# Altium schematic sheet Kello_uC.SchDoc
size A4; ApprovedBy: Krzysztof Belewicz; CheckedBy: Krzysztof Belewicz; Author: Krzysztof Belewicz; DrawnBy: Krzysztof Belewicz; Engineer: Krzysztof Belewicz; Revision: 1.0; SheetNumber: 1; SheetTotal: 4
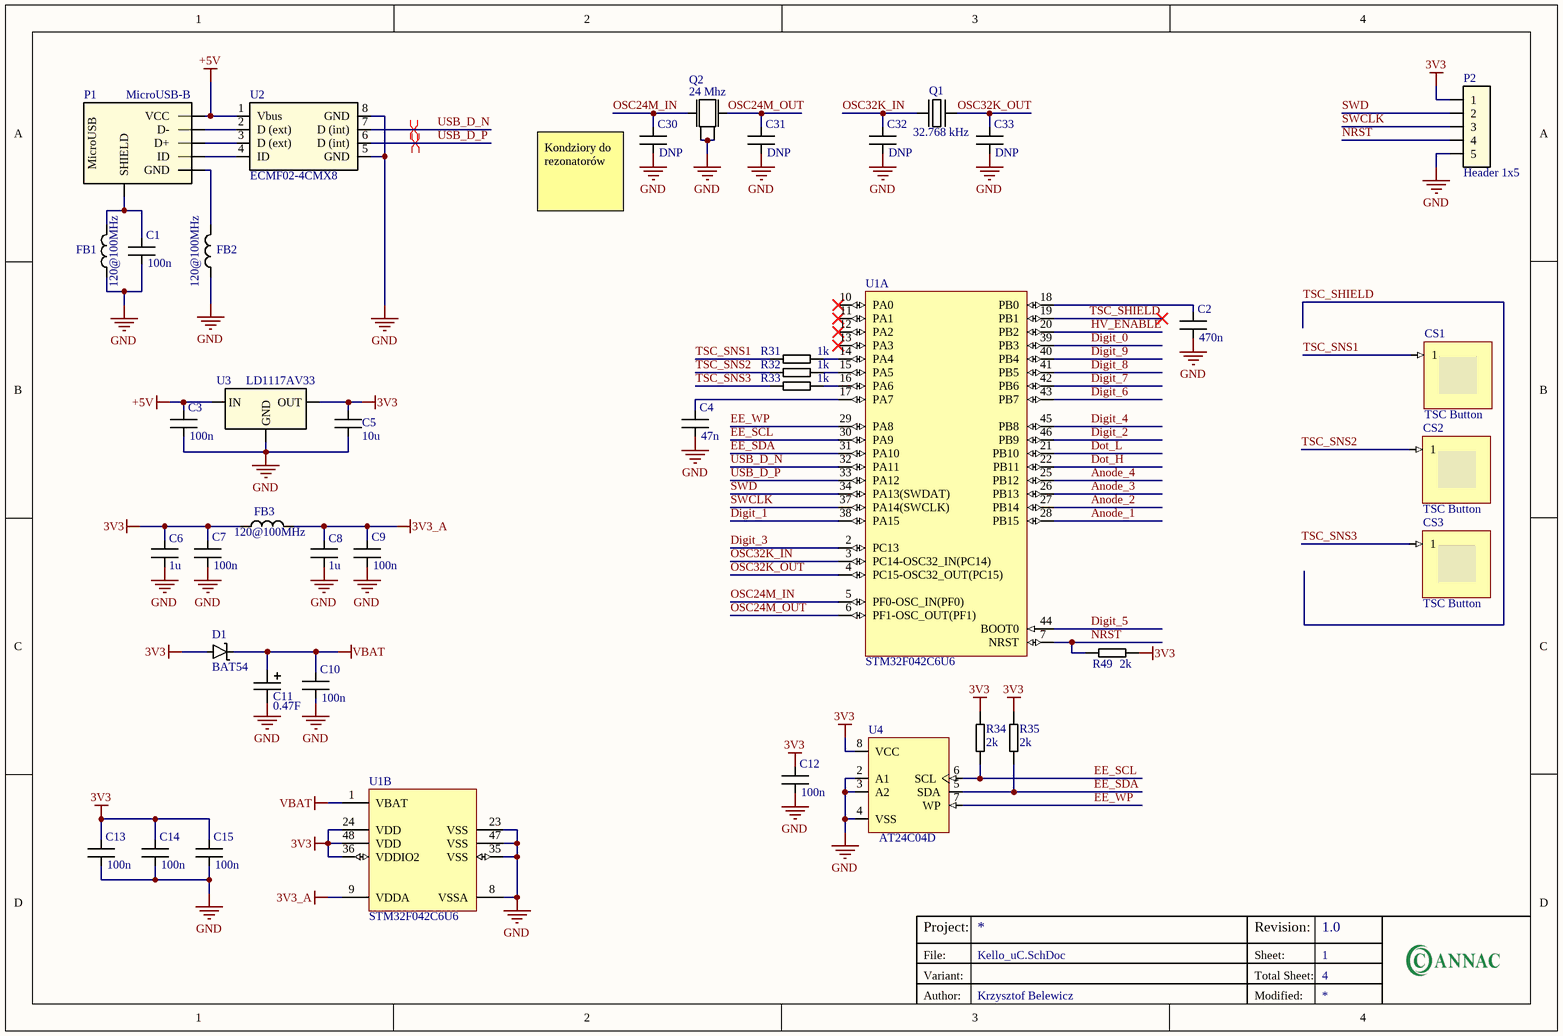
[diagram p0: Kello_uC.SchDoc]

## Parts
C1  value 100n  [CAPC1608N]  (hidden comment: Capacitor)
C2  value 470n  [CAPC1608N]  (hidden comment: Capacitor)
C3  value 100n  [CAPC1608N]  (hidden comment: Capacitor)
C4  value 47n  [CAPC1608N]  (hidden comment: Capacitor)
C5  value 10u  [CAPC1608N]  (hidden comment: Capacitor)
C6  value 1u  [CAPC1608N]  (hidden comment: Capacitor)
C7  value 100n  [CAPC1608N]  (hidden comment: Capacitor)
C8  value 1u  [CAPC1608N]  (hidden comment: Capacitor)
C9  value 100n  [CAPC1608N]  (hidden comment: Capacitor)
C10  value 100n  [CAPC1608N]  (hidden comment: Capacitor)
C11  0.47F  [FGH0V474ZF]
C12  value 100n  [CAPC1608N]  (hidden comment: Capacitor)
C13  value 100n  [CAPC1608N]  (hidden comment: Capacitor)
C14  value 100n  [CAPC1608N]  (hidden comment: Capacitor)
C15  value 100n  [CAPC1608N]  (hidden comment: Capacitor)
C30  value DNP  [CAPC1608N]  (hidden comment: Capacitor)
C31  value DNP  [CAPC1608N]  (hidden comment: Capacitor)
C32  value DNP  [CAPC1608N]  (hidden comment: Capacitor)
C33  value DNP  [CAPC1608N]  (hidden comment: Capacitor)
CS1  TSC Button  (no BOM)
CS2  TSC Button  (no BOM)
CS3  TSC Button  (no BOM)
D1  BAT54  [SOD-523F]
FB1  value 120@100MHz  [INDC1608N]  (hidden comment: Ferrite Bead)
FB2  value 120@100MHz  [INDC1608N]  (hidden comment: Ferrite Bead)
FB3  value 120@100MHz  [INDC1608N]  (hidden comment: Ferrite Bead)
P1  MicroUSB-B  [MicroUSB-B (47346-0001)]
P2  Header 1x5  [Header 1x5, Male, 2.54mm, Straight, THT]
Q1  value 32.768 kHz  [IL3X2]  (hidden comment: Crystal 2 pin)
Q2  value 24 Mhz  [CFPX-5]  (hidden comment: 24Mhz)
R31  value 1k  [RESC1608N]  (hidden comment: Resistor)
R32  value 1k  [RESC1608N]  (hidden comment: Resistor)
R33  value 1k  [RESC1608N]  (hidden comment: Resistor)
R34  value 2k  [RESC1608N]  (hidden comment: Resistor)
R35  value 2k  [RESC1608N]  (hidden comment: Resistor)
R49  value 2k  [RESC1608N]  (hidden comment: Resistor)
U1  STM32F042C6U6  [STM-UFQFPN48_N]  (parts A,B of 2)
U2  ECMF02-4CMX8  [uQFN-8]
U3  LD1117AV33  [SOT223_N]
U4  AT24C04D  [DFN-MC8]

## Nets
3V3: C5.2 C6.2 C7.2 C12.2 C13.2 C14.2 C15.2 D1.A FB3.1 P2.1 R34.1 R35.1 R49.2 U1.24(VDD) U1.36(VDDIO2) U1.48(VDD) U3.2(OUT) U4.8(VCC)
3V3_A: C8.2 C9.2 FB3.2 U1.9(VDDA)
+5V: C3.2 P1.1(VCC) U2.1(Vbus) U3.3(IN)
GND: C1.1 C2.1 C3.1 C4.1 C5.1 C6.1 C7.1 C8.1 C9.1 C10.1 C11.2 C12.1 C13.1 C14.1 C15.1 C30.1 C31.1 C32.1 C33.1 FB1.2 FB2.2 P2.5 Q2.2 Q2.4 U1.8(VSSA) U1.23(VSS) U1.35(VSS) U1.47(VSS) U2.5(GND) U2.8(GND) U3.1(GND) U4.2(A1) U4.3(A2) U4.4(VSS)
VBAT: C10.2 C11.1 D1.K U1.1(VBAT)
Anode_1: U1.28(PB15)
Anode_2: U1.27(PB14)
Anode_3: U1.26(PB13)
Anode_4: U1.25(PB12)
Digit_0: U1.39(PB3)
Digit_1: U1.38(PA15)
Digit_2: U1.46(PB9)
Digit_3: U1.2(PC13)
Digit_4: U1.45(PB8)
Digit_5: U1.44(BOOT0)
Digit_6: U1.43(PB7)
Digit_7: U1.42(PB6)
Digit_8: U1.41(PB5)
Digit_9: U1.40(PB4)
Dot_H: U1.22(PB11)
Dot_L: U1.21(PB10)
EE_SCL: R34.2 U1.30(PA9) U4.6(SCL)
EE_SDA: R35.2 U1.31(PA10) U4.5(SDA)
EE_WP: U1.29(PA8) U4.7(WP)
HV_ENABLE: U1.20(PB2)
NRST: P2.4 R49.1 U1.7(NRST)
OSC24M_IN: C30.2 Q2.1 U1.5(PF0-OSC_IN(PF0))
OSC24M_OUT: C31.2 Q2.3 U1.6(PF1-OSC_OUT(PF1))
OSC32K_IN: C32.2 Q1.1 U1.3(PC14-OSC32_IN(PC14))
OSC32K_OUT: C33.2 Q1.2 U1.4(PC15-OSC32_OUT(PC15))
SWCLK: P2.3 U1.37(PA14(SWCLK))
SWD: P2.2 U1.34(PA13(SWDAT))
TSC_SHIELD: U1.19(PB1)
TSC_SNS1: CS1.1 R31.1
TSC_SNS2: CS2.1 R32.1
TSC_SNS3: CS3.1 R33.1
USB_D_N: U1.32(PA11) U2.7(D_(int))
USB_D_P: U1.33(PA12) U2.6(D_(int))
NetC1_2: C1.2 FB1.1 P1.6(SHIELD)
NetC2_2: C2.2 U1.18(PB0)
NetC4_2: C4.2 U1.17(PA7)
NetFB2_1: FB2.1 P1.5(GND)
NetP1_2: P1.2(D-) U2.2(D_(ext))
NetP1_3: P1.3(D+) U2.3(D_(ext))
NetP1_4: P1.4(ID) U2.4(ID)
NetR31_2: R31.2 U1.14(PA4)
NetR32_2: R32.2 U1.15(PA5)
NetR33_2: R33.2 U1.16(PA6)

Not connected (* = marked no-connect by the designer): U1 10(PA0)* 11(PA1)* 12(PA2)* 13(PA3)*

## Layout directives
differential pair: USB_D_N, USB_D_P

## Notes on the sheet
- (near C30) Kondziory do rezonatorów
- Project:
- Variant:
- File:
- Sheet:
- Revision:
- Total Sheet:
- Author:
- Modified:
- (in symbol 47346-0001) MicroUSB

## Library data of the parts
C1 C3 C7 C9 C10 C12-C15 = Capacitor: Manufacturer Part Number 1: CL10F104ZA8NNNC; Manufacturer 1: SAMSUNG; Tolerance: -20/+80%; MaxVoltage: 25V; Supplier 1: TME; Supplier Part Number 1: CL10F104ZA8NNNC
C2 = Capacitor: Manufacturer Part Number 1: 0603B474K100CT; Manufacturer 1: WALSIN; Tolerance: 10%; MaxVoltage: 10V; Supplier 1: Farnell; Supplier Part Number 1: 2524844
C4 = Capacitor: Manufacturer Part Number 1: VJ0603Y473KXJCW1BC; Manufacturer 1: VISHAY; Tolerance: 10%; MaxVoltage: 16V; Supplier 1: TME; Supplier Part Number 1: VJ0603Y473KXJCW1BC
C5 = Capacitor: Manufacturer Part Number 1: GRM188R60J106ME47D; Manufacturer 1: MURATA; Tolerance: 20%; MaxVoltage: 6.3V; Supplier 1: TME; Supplier Part Number 1: GRM188R60J106ME47D
C6 C8 = Capacitor: Manufacturer Part Number 1: GCM188R71E105KA64D; Manufacturer 1: MURATA; Tolerance: 10%; MaxVoltage: 25V; Supplier 1: TME; Supplier Part Number 1: GCM188R71E105KA64D
C11 = FGH0V474ZF: Kondensator: elektrolityczny; 0.47F; 3,5VDC; ESR:25Ω; SMD; -20÷+80%; Manufacturer 1: KEMET; Max Voltage: 3.5V; ESR: 25Ohm; Supplier 1: TME; Manufacturer Part Number 1: FGH0V474ZF; Supplier Part Number 1: FGH0V474ZF; Value: 0.47F
CS1-CS3 = QTouchButton: QTouch Button; ConfiguratorName: ATMEL_TOUCH; ConfigurationParameters: {}__sensorid[1]{}width[15]{}height[15]{}
D1 = BAT54XV2: Fairchild BAT54XV2, Schottky, 200mA, 30V; Supplier 1: Farnell; Supplier Part Number 1: 2322476; Forward Current: 200mA; Max Reverse Voltage: 30V; Manufacturer: Fairchild; Manufacturer Part Number: BAT54XV2; Supplier 2: RS-Components; Supplier Part Number 2: 690-0029
FB1-FB3 = Inductor: Max Current: 3A; Tolerance: *; Supplier 1: TME; Supplier 2: *; Supplier Part Number 1: BLM18KG121TN1D
P1 = 47346-0001: Molex MicroUSB-B, SMD (P/N 47346-0001); Manufacturer Part Number 1: 473460001; Supplier 1: TME; Supplier Part Number 1: MX-47346-0001; Manufacturer 1: MOLEX
P2 = Header 1x5: Pin header, 1x5, 2.54mm; Supplier Part Number 1: *; Supplier 1: *
Q1 = Crystal 2 pin: Manufacturer 1: ILSI; Manufacturer Part Number 1: IL3X2-HX5F12.5-32.768KHZ; Supplier Part Number 1: IL3X2-HX5F12.5-32.768KHZ; Supplier 1: TME
Q2 = Crystal 4 pin: Manufacturer Part Number 1: 3225-24M-SR; Manufacturer 1: SR PASSIVES; Supplier 1: TME; Supplier Part Number 1: 3225-24M-SR
R31-R33 = Resistor: Manufacturer 1: ROYAL OHM; Manufacturer Part Number 1: 0603SAF1001T5E; Tolerance: 1%; Power: 0.1W; Supplier 1: TME; Supplier Part Number 1: SMD0603-1K-1%
R34 R35 R49 = Resistor: Manufacturer 1: ROYAL OHM; Manufacturer Part Number 1: 0603SAF2001T5E; Tolerance: 1%; Power: 0.1W; Supplier 1: TME; Supplier Part Number 1: SMD0603-2K-1%
U1 = STM32F042C6U6: ARM Cortex-M0 32-bit MCU, 32 KB Flash, 6 KB Internal RAM, 38 I/Os, 48-pin UFQFPN, -40 to 85 degC; FLASH Size (Prog) (kB): 32; I/Os (High Current): 38; Internal RAM Size (kB): 6; Operating Frequency(F) (Processor speed) (MHz): 48; Packing: Tray; Supply Voltage(Vcc) min (V): 2; DatasheetVersion: Rev. 3; PackageVersion: Rev. 6, 06/2013; PackageReference: UFQFPN48; PackageDescription: 48-Pin Low Profile Quad Flat Package, 7 x 7 mm Body, 0.5 mm Pitch; Supplier 1: TME; Supplier Part Number 1: STM32F042C6U6; Core: ARM Cortex-M0; Mounting Technology: Surface Mount; PartNumber: STM32F042C6U6; ComponentLink1Description: Manufacturer URL; ComponentLink1URL: http://www.st.com/web/en/home.html; ComponentLink2Description: Datasheet; ComponentLink2URL: http://www.st.com/st-web-ui/static/active/en/resource/technical/document/datasheet/DM00039193.pdf; ComponentLink3Description: Package Specification; ComponentLink3URL: http://www.st.com/st-web-ui/static/active/en/resource/technical/document/datasheet/DM00058181.pdf
U2 = ECMF02-4CMX8: STMicroelectronics Common Mode Filter with ESD protection, USB compatible; Supplier 1: Farnell; Supplier Part Number 1: 2629721; Manufacturer: STMicroelectronics; Manufacturer Part Number: ECMF02-4CMX8
U3 = LD1117AS33TR: Stabilizator napięcia; LDO, liniowy, nieregulowany; 3,3V; 1A; SMD; Manufacturer 1: ST MICROELECTRONICS; Output Voltage: 3.3V; Supplier Part Number 1: LD1117AS33; Supplier 1: TME; Max Current: 1A; Manufacturer Part Number 1: LD1117AS33TR
U4 = AT24C04D-MAHM-T: 4Kbit, 1MHz, 1.7V-3.6V, I2C Serial EEPROM, 8-Pin DFN, Industrial Temperature, Tape and Reel; Manufacturer 1: MICROCHIP; PackageReference: DFN-MC8; Manufacturer Part Number 1: AT24C04D-MAHM-T; Supplier 1: TME; Supplier Part Number 1: AT24C04D-MAHM-T
C30-C33 = Capacitor: Tolerance: *; MaxVoltage: *; Supplier 1: *; Manufacturer 1: *; Supplier Part Number 1: *; Manufacturer Part Number 1: *